# Altium project GPS.PrjPCB
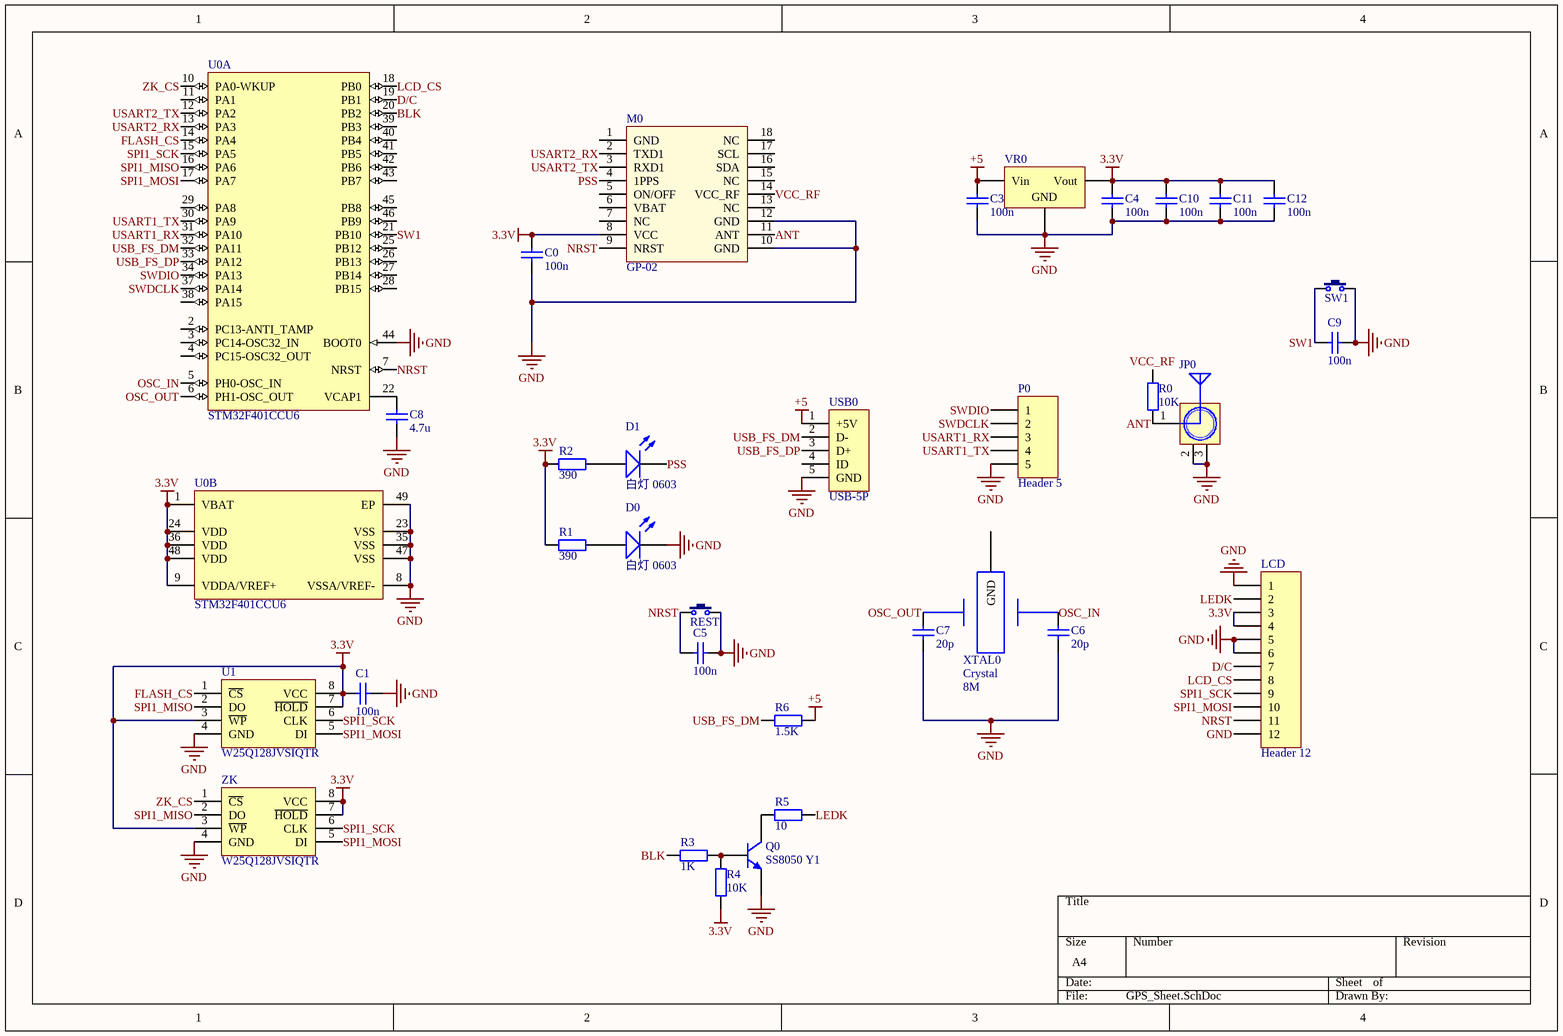
[diagram p0: GPS_Sheet.SchDoc]
1 sheet, 34 parts. Net scope: global (net labels, ports and power ports of the same name join across sheets).
Board files: GPS_PCB.PcbDoc, GPS_Board_4.PcbDoc

## Sheet GPS_Sheet.SchDoc
size A4

### Parts
C0  100n  [0805_C]
C1  100n  [0805_C]
C3  100n  [0805_C]
C4  100n  [0805_C]
C5  100n  [0805_C]
C6  20p  [0805_C]
C7  20p  [0805_C]
C8  4.7u  [0805_C]
C9  100n  [0805_C]
C10  100n  [0805_C]
C11  100n  [0805_C]
C12  100n  [0805_C]
D0  白灯 0603  [0603_LED_S1]
D1  白灯 0603  [0603_LED_S1]
JP0  SMA  [IPX]  (value not drawn)
LCD  Header 12  [1.3_inch_LCD]
M0  GP-02  [GP-02]
P0  Header 5  [HDR1X5]
Q0  SS8050 Y1  [SOT-23(SOT-23-3)]
R0  10K  [0805_R]
R1  390  [0805_R]
R2  390  [0805_R]
R3  1K  [0805_R]
R4  10K  [0805_R]
R5  10  [0805_R]
R6  1.5K  [0805_R]
REST  3x6x5  [TSW SMD-3*6*2.5]  (value not drawn)
SW1  3x6x5  [TSW SMD-3*6*2.5]  (value not drawn)
U0  STM32F401CCU6  [STM-UFQFPN48_N]  (parts A,B of 2)
U1  W25Q128JVSIQTR  [SOIC-8_208mil]
USB0  USB-5P  [USB-MICRO_B]
VR0  AMS1117-3.3  [SOT-223]  (value not drawn)
XTAL0  Crystal  Frequence: 8M  [XTAL_DIP]
ZK  W25Q128JVSIQTR  [SOIC-8_208mil]

### Nets
3.3V: C0.2 C1.2 C4.2 C10.2 C11.2 C12.2 LCD.3 LCD.4 M0.8(VCC) R1.1 R2.1 R4.1 U0.1(VBAT) U0.9(VDDA/VREF+) U0.24(VDD) U0.36(VDD) U0.48(VDD) U1.3(~{WP}) U1.7(~{HOLD}) U1.8(VCC) VR0.2(Vout) ZK.3(~{WP}) ZK.7(~{HOLD}) ZK.8(VCC)
+5: C3.2 R6.2 USB0.1(+5V) VR0.3(Vin)
GND: C0.1 C1.1 C3.1 C4.1 C5.2 C6.1 C7.1 C8.1 C9.2 C10.1 C11.1 C12.1 D0.K JP0.2(GND) JP0.3(GND) LCD.1 LCD.5 LCD.6 LCD.12 M0.10(GND) M0.12(GND) P0.5 Q0.2(E) REST.2 SW1.2 U0.8(VSSA/VREF-) U0.23(VSS) U0.35(VSS) U0.44(BOOT0) U0.47(VSS) U0.49(EP) U1.4(GND) USB0.5(GND) VR0.1(GND) ZK.4(GND)
ANT: JP0.1(ANT) M0.11(ANT) R0.1
BLK: R3.2 U0.20(PB2)
D/C: LCD.7 U0.19(PB1)
FLASH_CS: U0.14(PA4) U1.1(~{CS})
LCD_CS: LCD.8 U0.18(PB0)
LEDK: LCD.2 R5.2
NRST: C5.1 LCD.11 M0.9(NRST) REST.1 U0.7(NRST)
OSC_IN: C6.2 U0.5(PH0-OSC_IN) XTAL0.1
OSC_OUT: C7.2 U0.6(PH1-OSC_OUT) XTAL0.2
PSS: D1.K M0.4(1PPS)
SPI1_MISO: U0.16(PA6) U1.2(DO) ZK.2(DO)
SPI1_MOSI: LCD.10 U0.17(PA7) U1.5(DI) ZK.5(DI)
SPI1_SCK: LCD.9 U0.15(PA5) U1.6(CLK) ZK.6(CLK)
SW1: C9.1 SW1.1 U0.21(PB10)
SWDCLK: P0.2 U0.37(PA14)
SWDIO: P0.1 U0.34(PA13)
USART1_RX: P0.3 U0.31(PA10)
USART1_TX: P0.4 U0.30(PA9)
USART2_RX: M0.2(TXD1) U0.13(PA3)
USART2_TX: M0.3(RXD1) U0.12(PA2)
USB_FS_DM: R6.1 U0.32(PA11) USB0.2(D-)
USB_FS_DP: U0.33(PA12) USB0.3(D+)
VCC_RF: M0.14(VCC_RF) R0.2
ZK_CS: U0.10(PA0-WKUP) ZK.1(~{CS})
NetC8_2: C8.2 U0.22(VCAP1)
NetD0_A: D0.A R1.2
NetD1_A: D1.A R2.2
NetQ0_1: Q0.1(B) R3.1 R4.2
NetQ0_3: Q0.3(C) R5.1

Not connected (* = marked no-connect by the designer): M0 1(GND) 5(ON/OFF) 6(VBAT) 7(NC) 13(NC) 15(NC) 16(SDA) 17(SCL) 18(NC); U0 2(PC13-ANTI_TAMP) 3(PC14-OSC32_IN) 4(PC15-OSC32_OUT) 11(PA1) 25(PB12) 26(PB13) 27(PB14) 28(PB15) 29(PA8) 38(PA15) 39(PB3) 40(PB4) 41(PB5) 42(PB6) 43(PB7) 45(PB8) 46(PB9); USB0 4(ID); XTAL0 3(GND)

### Library data of the parts
C0 C1 C3-C5 C9-C12 = 0805 100nF(104) 10% 50V: 贴片电容; ComponentLink1Description: 供应商链接; ComponentLink1URL: http://www.szlcsc.com/product/details_50686.html; Package: 0805; Supplier: LC; SuppliersPartNumber: C49678
C6 C7 = 0805 20pF (200) 5% 50V: 贴片电容; ComponentLink1Description: 供应商链接; ComponentLink1URL: http://www.szlcsc.com/product/details_2150.html; Package: 0805; Supplier: LC; SuppliersPartNumber: C1798
C8 = 0805 4.7uF (475) 10% 25V: 贴片电容; ComponentLink1Description: 供应商链接; ComponentLink1URL: http://www.szlcsc.com/product/details_2131.html; Package: 0805; Supplier: LC; SuppliersPartNumber: C1779
D0 D1 = 0603 白灯: 发光二极管; ComponentLink1Description: 供应商链接; ComponentLink1URL: http://www.szlcsc.com/product/details_2663.html; Package: 0603; Supplier: LC; SuppliersPartNumber: C2290
JP0 = SMA: SMA-2.4G射频天线接口; pin to pad: 3>2; 版权归属: 源创客; BOM名称: SMA-2.4G射频天线接口; 学习资源: www.ooocke.com
LCD = Header 12: Header, 12-Pin; LatestRevisionDate: 17-Jul-2002; LatestRevisionNote: Re-released for DXP Platform.; Publisher: Altium Limited
P0 = Header 5: Header, 5-Pin; LatestRevisionDate: 17-Jul-2002; LatestRevisionNote: Re-released for DXP Platform.; Publisher: Altium Limited
Q0 = SOT-23 SS8050 Y1: 三极管; ComponentLink1Description: 供应商链接; ComponentLink1URL: http://www.szlcsc.com/product/details_2507.html; Package: SOT-23; Supplier: LC; SuppliersPartNumber: C2150
R0 R4 = 0805 10KΩ (1002) 1%: 贴片电阻; ComponentLink1Description: 供应商链接; ComponentLink1URL: http://www.szlcsc.com/product/details_18102.html; Package: 0805; Supplier: LC; SuppliersPartNumber: C17414
R1 R2 = 0805 390Ω (3900) 1%: 贴片电阻; ComponentLink1Description: 供应商链接; ComponentLink1URL: http://www.szlcsc.com/product/details_18343.html; Package: 0805; Supplier: LC; SuppliersPartNumber: C17655
R3 = 0805 1KΩ (1001) 1%: 贴片电阻; ComponentLink1Description: 供应商链接; ComponentLink1URL: http://www.szlcsc.com/product/details_18201.html; Package: 0805; Supplier: LC; SuppliersPartNumber: C17513
R5 = 0805 10Ω (10R0) 1%: 贴片电阻; ComponentLink1Description: 供应商链接; ComponentLink1URL: http://www.szlcsc.com/product/details_18103.html; Package: 0805; Supplier: LC; SuppliersPartNumber: C17415
R6 = 0805 1.5KΩ (1501) 1%: 贴片电阻; ComponentLink1Description: 供应商链接; ComponentLink1URL: http://www.szlcsc.com/product/details_4717.html; Package: 0805; Supplier: LC; SuppliersPartNumber: C4310
REST SW1 = TSW 3x6: 3x6轻触开关; 版权归属: 源创客; BOM名称: 3x6轻触开关; 学习资源: www.ooocke.com
U0 = STM32F401CCU6: ARM Cortex-M4 32-bit MCU+FPU, 105 DMIPS, 256 kB Flash, 64 kB Internal RAM, 36 I/Os, 48-pin UFQFPN, -40 to 85 degC, Tray; Manufacturer: STMicroelectronics; FLASH Size (Prog) (kB): 256; I/Os (High Current): 36; Internal RAM Size (kB): 64; Operating Frequency(F) (Processor speed) (MHz): 84; Supply Voltage(Vcc) max (V): 3.6; Supply Voltage(Vcc) min (V): 1.8; DatasheetVersion: Rev. 1; PackageVersion: Rev. 1, 04/2013; PackageReference: UFQFPN48; PackageDescription: 48-Pin Ultra Thin Fine Pitch Quad Flat No-Lead, 7 x 7 x 0.6 mm Body, 0.5 mm Pitch, Exposed Pad; Supplier 1: Newark; Supplier Part Number 1: 19X6217; Supplier 2: Mouser; Supplier Part Number 2: 511-STM32F401CCU6; Core: ARM Cortex-M4; Packing: Tray; Mounting Technology: Surface Mount; PartNumber: STM32F401CCU6; ComponentLink1Description: Manufacturer URL; ComponentLink1URL: http://www.st.com/web/en/home.html; ComponentLink2Description: Datasheet; ComponentLink2URL: http://www.st.com/st-web-ui/static/active/en/resource/technical/document/data_brief/DM00071938.pdf; ComponentLink3Description: Package Specification; ComponentLink3URL: http://www.st.com/st-web-ui/static/active/en/resource/technical/document/data_brief/DM00071938.pdf
U1 ZK = W25Q128JVSIQTR_[C97521]: Flash ROM; ComponentLink1Description: 供应商链接; ComponentLink1URL: https://item.szlcsc.com/98729.html; Package: SOIC-8; Supplier: LC; SuppliersPartNumber: C97521
USB0 = USB-5P: 微型USB母座; 版权归属: 源创客; BOM名称: 微型USB母座; 学习资源: www.ooocke.com
VR0 = SOT-223 AMS1117-3.3: 低压差线性稳压(LDO); ComponentLink1Description: 供应商链接; ComponentLink1URL: http://www.szlcsc.com/product/details_6652.html; Package: SOT-223; Supplier: LC; SuppliersPartNumber: C6186
XTAL0 = XTAL: Crystal without source